# EasyEDA Pro project W51FXXXXS16_EVB_NONOFFICIAL_2026-06-30.epro

# Schematic Schematic1
Board Name: Board1; Create Date: 2026-06-29; Page Name: P1; Project Name: W51FXXXXS16_EVB_NO; Schematic Name: Schematic1; Update Date: 2026-06-29; Company: EasyEDA.com; Page Size: A4; Version: V1.0
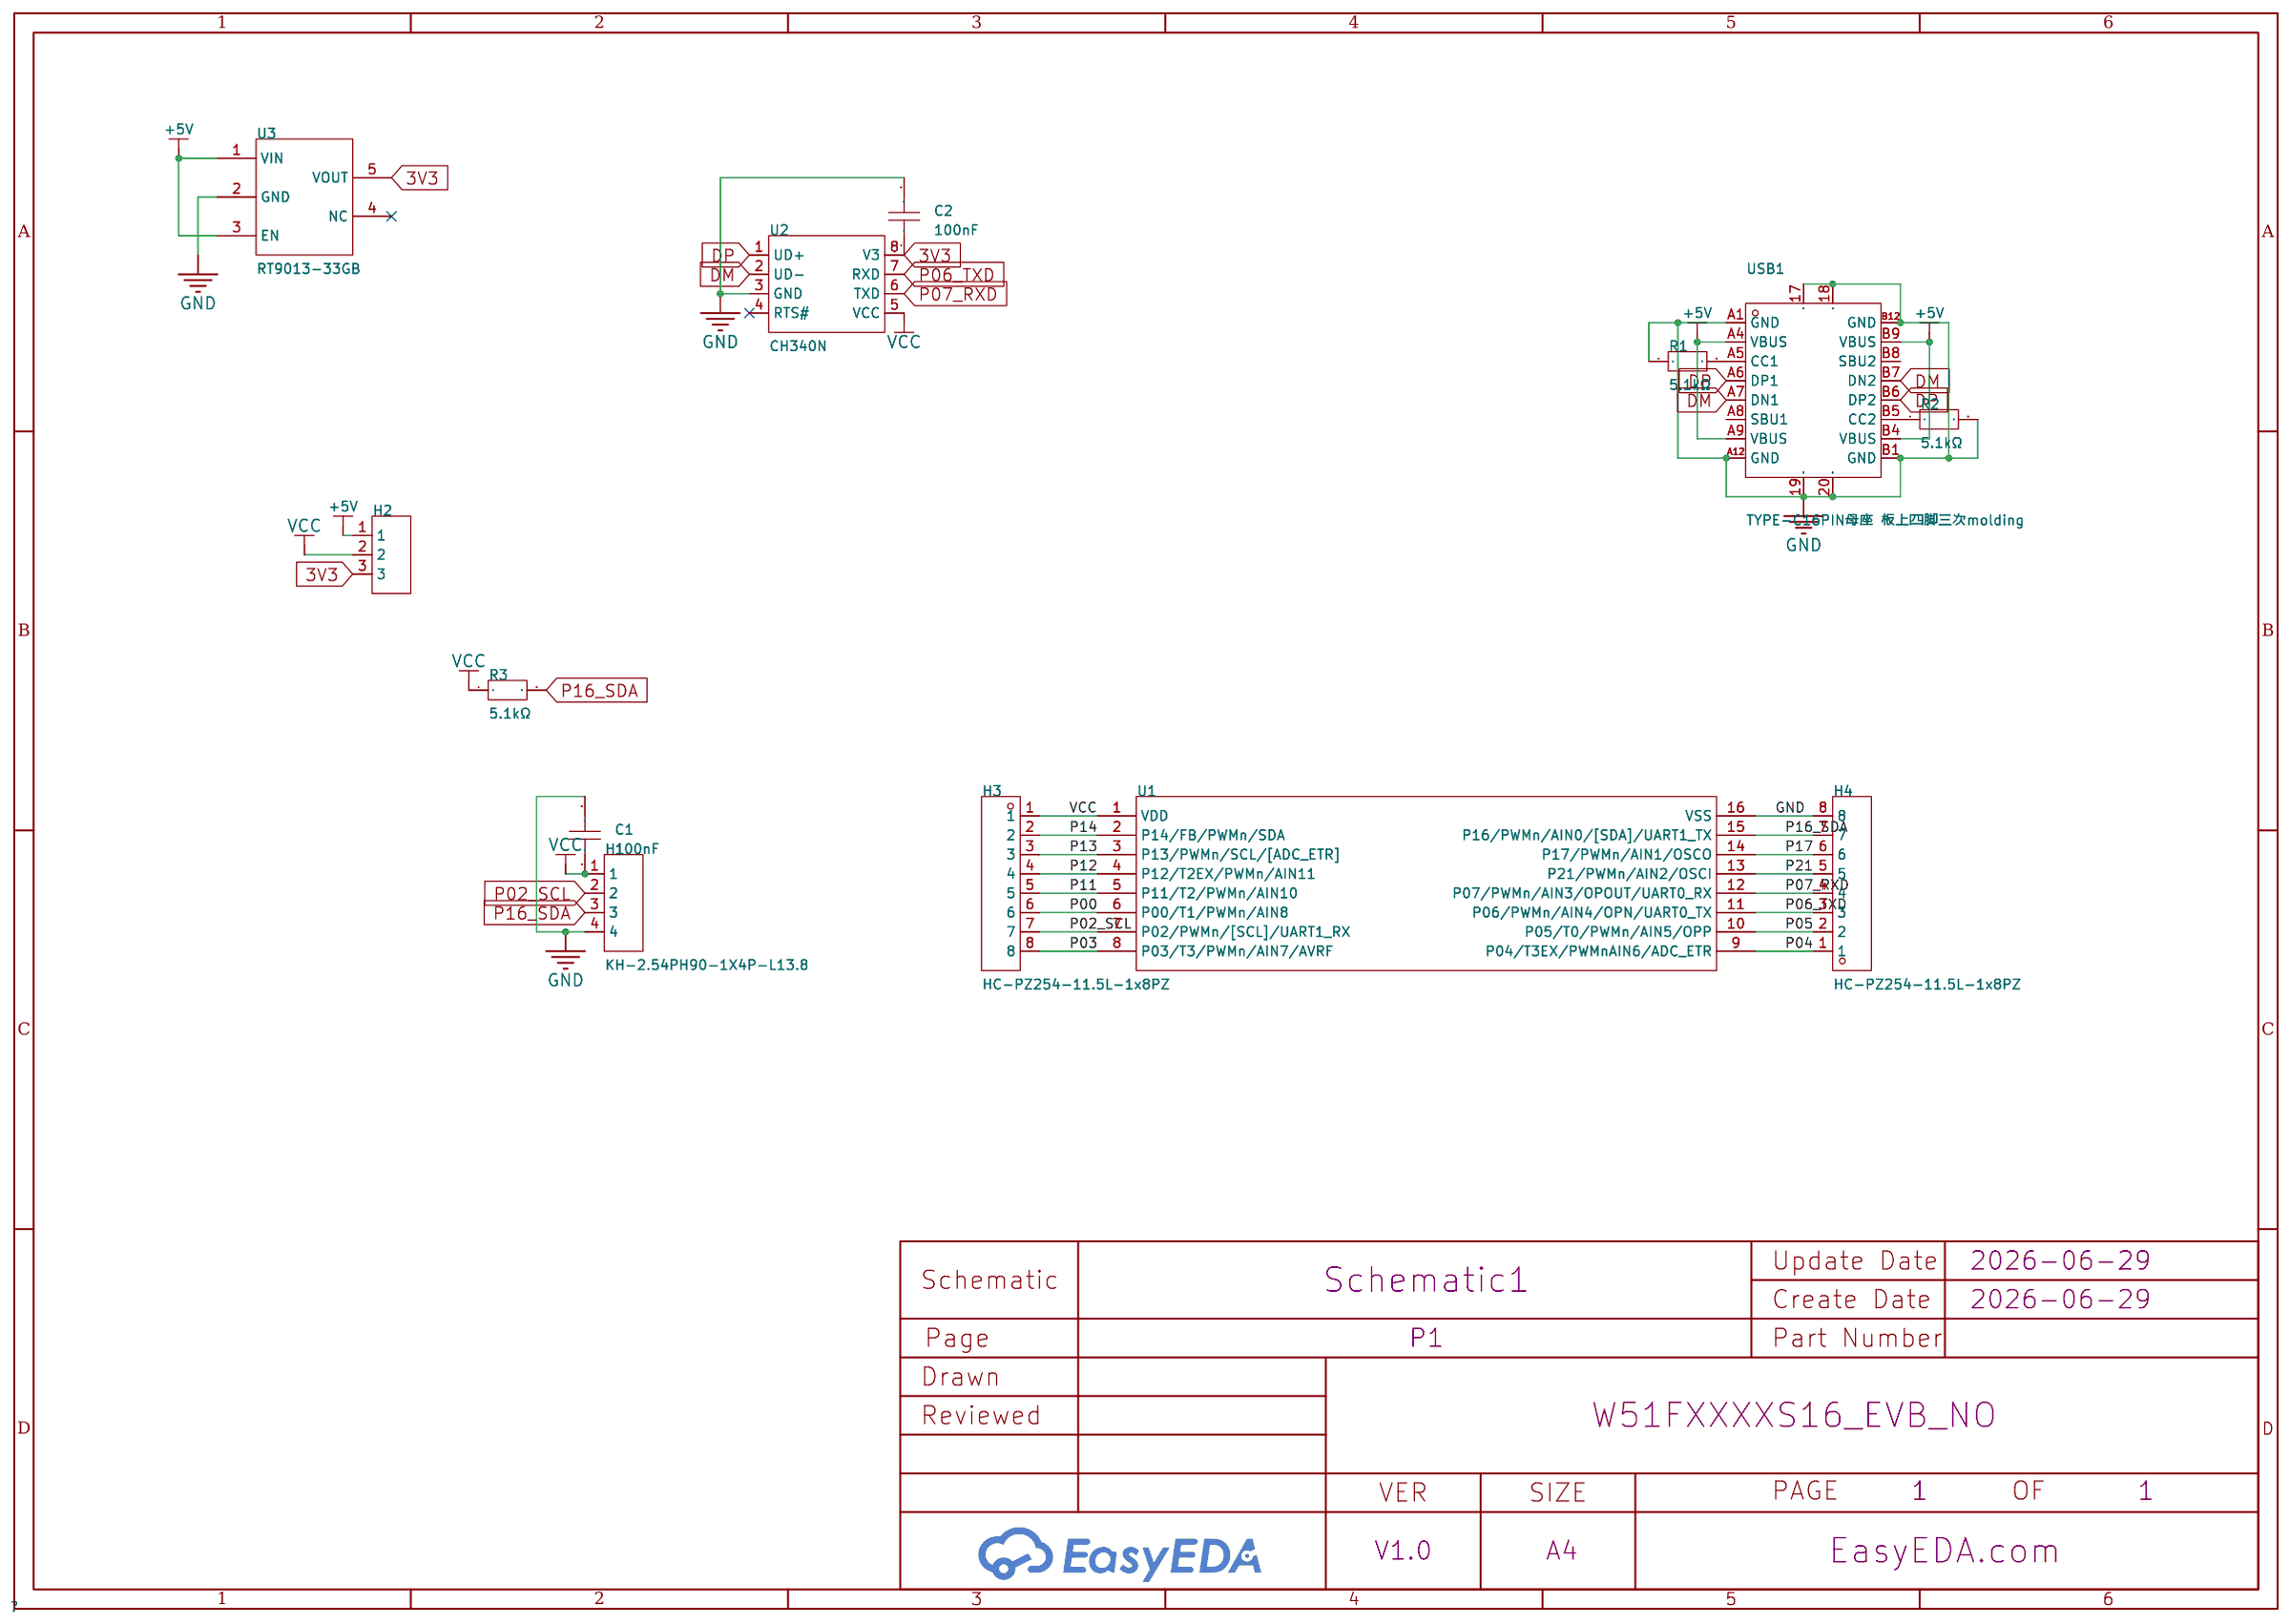
[diagram p0: schematic sheet]

## Parts
C1  100nF  [C1206]
C2  100nF  [C1206]
H1  KH-2.54PH90-1X4P-L13.8  [HDR-TH_4P-P2.54-H-M-W10.4-N]
H2  -  [HDR-TH_3P-P2.54-V-M]
H3  HC-PZ254-11.5L-1x8PZ  [HDR-TH_8P-P2.54-V-M]
H4  HC-PZ254-11.5L-1x8PZ  [HDR-TH_8P-P2.54-V-M]
R1  5.1kΩ  [R1206]
R2  5.1kΩ  [R1206]
R3  5.1kΩ  [R1206]
U1  -  [SOP-16_L10.0-W3.9-P1.27-LS6.0-TR]
U2  CH340N  [SOP-8_L4.9-W3.9-P1.27-LS6.0-BL]
U3  RT9013-33GB  [SOT-23-5_L3.0-W1.7-P0.95-LS2.8-BL]
USB1  TYPE-C16PIN母座 板上四脚三次molding  [USB-SMD_TYPE-C16PIN]

## Library data of the parts
C1 C2 = VJ1206Y104KLCAJ32: Capacitance:100nF Tolerance:±10% Tolerance:±10% Voltage Rating:200V Temperature Coefficient:X7R; LCSC Part Name: 100nF ±10% 200V; Supplier Part: C1513543; Manufacturer: VISHAY(威世); Supplier Footprint: 1206; JLCPCB Part Class: Extended Part; Datasheet: https://atta.szlcsc.com/upload/public/pdf/source/20210428/14560EB756A41667B9808D9FE1DC9776.pdf; Supplier: LCSC; Tolerance: ±10%; Voltage Rating: 200V; Temperature Coefficient: X7R
H1 = KH-2.54PH90-1X4P-L13.8: Pin Structure:1x4P Pitch:2.54mm Row Spacing:- Circluar Pins/Square Pins:Pin Header Mounting Type:Right Angle Number of Rows:1 Number of Pins:4P Current Rating:3A Voltage Rating (Max):- Length of Mating Pin:6mm Insulation Height:2.5mm Length of End Connect; LCSC Part Name: 1x4P 间距:2.54mm 方针 弯插; Supplier Part: C2905425; Manufacturer: kinghelm(金航标); Supplier Footprint: 弯插,P=2.54mm; JLCPCB Part Class: Extended Part; Datasheet: https://item.szlcsc.com/datasheet/KH-2.54PH90-1X4P-L13.8/3175213.html; Supplier: LCSC; Pin Structure: 1x4P; Pitch: 2.54mm; Circluar Pins/Square Pins: Pin Header; Mounting Type: Right Angle; Number of Rows: 1; Number of Pins: 4P; Current Rating: 3A; Length of Mating Pin: 6mm; Insulation Height: 2.5mm; Operating Temperature: -40℃~+105℃; Color: Black
H2 = HDR-M_2.54_1x3P: Supplier Footprint: Through
H3 H4 = HC-PZ254-11.5L-1x8PZ: Pin Structure:1x8P Pitch:2.54mm Row Spacing:- Circluar Pins/Square Pins:Pin Header Mounting Type:Through Hole Number of Rows:1 Number of Pins:8P Current Rating:3A Voltage Rating (Max):- Length of Mating Pin:6mm Insulation Height:2.5mm Length of End Connec; LCSC Part Name: 1x8P 间距:2.54mm 方针 直插; Supplier Part: C27985192; Manufacturer: HC(虹成电子); Supplier Footprint: 插件,P=2.54mm; JLCPCB Part Class: Extended Part; Datasheet: https://item.szlcsc.com/datasheet/HC-PZ254-11.5L-1x8PZ/29721150.html; Supplier: LCSC; Pin Structure: 1x8P; Pitch: 2.54mm; Circluar Pins/Square Pins: Pin Header; Mounting Type: Through Hole; Number of Rows: 1; Number of Pins: 8P; Current Rating: 3A; Length of Mating Pin: 6mm; Insulation Height: 2.5mm; Length of End Connection Pin: 3mm; Contact Material: Brass; Contact Plating: Gold; Operating Temperature: -40℃~+105℃; Color: Black
R1-R3 = CQ06W4F5101T5E: Type:Thick Film Resistor Resistance:5.1kΩ Tolerance:±1% Tolerance:±1% Power(Watts):250mW Voltage-Supply(Max):200V Temperature Coefficient:±100ppm/℃ Temperature Coefficient:±100ppm/℃ Operating Temperature:-55℃~+155℃ Operating Temperature:-55℃~+155℃; LCSC Part Name: 5.1kΩ ±1% 250mW 汽车级晶片电阻器; Supplier Part: C966417; Manufacturer: UNI-ROYAL(厚声); Supplier Footprint: 1206; JLCPCB Part Class: Extended Part; Datasheet: https://item.szlcsc.com/datasheet/CQ06W4F5101T5E/1052285.html; Supplier: LCSC; Type: Thick Film Resistor; Tolerance: ±1%; Power(Watts): 250mW; Voltage-Supply(Max): 200V; Temperature Coefficient: ±100ppm/℃; Operating Temperature: -55℃~+155℃
U1 = W51F6240S16: Low cost 1T 8051 MCU
U2 = CH340N: Applications Function:USB to serial USB Protocol:USB 2.0 Number of Channels:1 Voltage - Supply:3.3V；5V Voltage - Supply:3.3V；5V Data Rate:2Mbps Operating Temperature:-20℃~+70℃ Operating Temperature:-20℃~+70℃ Features:可编程波特率；内置时钟发生器；上电复位; LCSC Part Name: USB2.0芯片CH340; Supplier Part: C2977777; Manufacturer: WCH(南京沁恒); Supplier Footprint: SOP-8; JLCPCB Part Class: Extended Part; Datasheet: https://item.szlcsc.com/datasheet/CH340N/3390257.html; Supplier: LCSC; Applications Function: USB to serial; USB Protocol: USB 2.0; Number of Channels: 1; Voltage - Supply: 3.3V；5V; Data Rate: 2Mbps; Operating Temperature: -20℃~+70℃; Features: 可编程波特率；内置时钟发生器；上电复位
U3 = RT9013-33GB: Output Configuration:Positive Voltage - Supply:5.5V Output Voltage:3.3V Output Voltage:3.3V Output Current:500mA Power Supply Rejection Ratio (PSRR):50dB@(10kHz) Voltage Dropout:400mV@(500mA) standby current:25uA Noise:30uVrms Features:Enable control；Shor; LCSC Part Name: 3.3V 500mA 5.5V; Supplier Part: C47773; Manufacturer: RICHTEK(立锜); Supplier Footprint: SOT-23-5; JLCPCB Part Class: Extended Part; Datasheet: https://item.szlcsc.com/datasheet/RT9013-33GB/48778.html; Supplier: LCSC; Output Configuration: Positive; Voltage - Supply: 5.5V; Output Voltage: 3.3V; Output Current: 500mA; Power Supply Rejection Ratio (PSRR): 50dB@(10kHz); Voltage Dropout: 400mV@(500mA); standby current: 25uA; Noise: 30uVrms; Features: Enable control；Short Circuit Protection；Over Current Protection；Thermal shutdown; Operating Temperature: -40℃~+125℃@(Tj); Output Type: Fixed; Number of Outputs: 1
USB1 = TYPE-C16PIN母座 板上四脚三次molding: Supplier Part: C9900000202; Supplier Footprint: TYPE-C16PIN; JLCPCB Part Class: Extended Part; Supplier: LCSC

## Nets
3V3: C2.1 H2.3 U2.8(V3) U3.5(VOUT)
+5V: H2.1 U3.1(VIN) U3.3(EN) USB1.A4(VBUS) USB1.A9(VBUS) USB1.B4(VBUS) USB1.B9(VBUS)
GND: C1.2 C2.2 H1.4 H4.8 R1.1 R2.2 U1.16(VSS) U2.3(GND) U3.2(GND) USB1.17 USB1.18 USB1.19 USB1.20 USB1.A1(GND) USB1.A12(GND) USB1.B1(GND) USB1.B12(GND)
VCC: C1.1 H1.1 H2.2 H3.1 R3.1 U1.1(VDD) U2.5(VCC)
DM: U2.2(UD-) USB1.A7(DN1) USB1.B7(DN2)
DP: U2.1(UD+) USB1.A6(DP1) USB1.B6(DP2)
P00: H3.6 U1.6(P00/T1/PWMn/AIN8)
P02_SCL: H1.2 H3.7 U1.7(P02/PWMn/[SCL]/UART1_RX)
P03: H3.8 U1.8(P03/T3/PWMn/AIN7/AVRF)
P04: H4.1 U1.9(P04/T3EX/PWMnAIN6/ADC_ETR)
P05: H4.2 U1.10(P05/T0/PWMn/AIN5/OPP)
P06_TXD: H4.3 U1.11(P06/PWMn/AIN4/OPN/UART0_TX) U2.7(RXD)
P07_RXD: H4.4 U1.12(P07/PWMn/AIN3/OPOUT/UART0_RX) U2.6(TXD)
P11: H3.5 U1.5(P11/T2/PWMn/AIN10)
P12: H3.4 U1.4(P12/T2EX/PWMn/AIN11)
P13: H3.3 U1.3(P13/PWMn/SCL/[ADC_ETR])
P14: H3.2 U1.2(P14/FB/PWMn/SDA)
P16_SDA: H1.3 H4.7 R3.2 U1.15(P16/PWMn/AIN0/[SDA]/UART1_TX)
P17: H4.6 U1.14(P17/PWMn/AIN1/OSCO)
P21: H4.5 U1.13(P21/PWMn/AIN2/OSCI)
$1N2443: R1.2 USB1.A5(CC1)
$1N2482: R2.1 USB1.B5(CC2)

Not connected (* = marked no-connect by the designer): U2 4(RTS#)*; U3 4(NC)*; USB1 A8(SBU1) B8(SBU2)

# Board PCB1
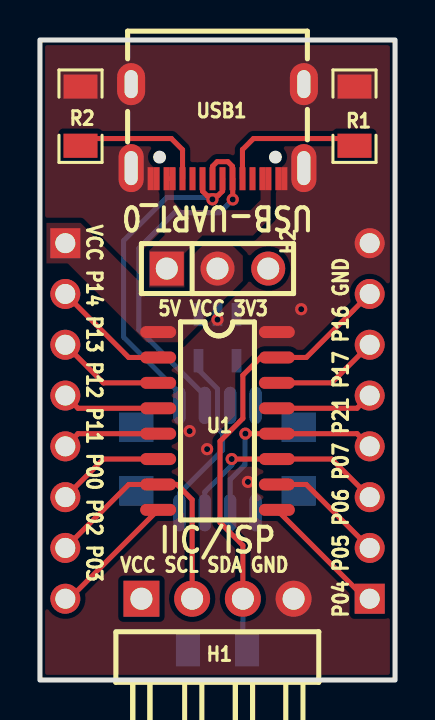
[diagram p1: board, top side]
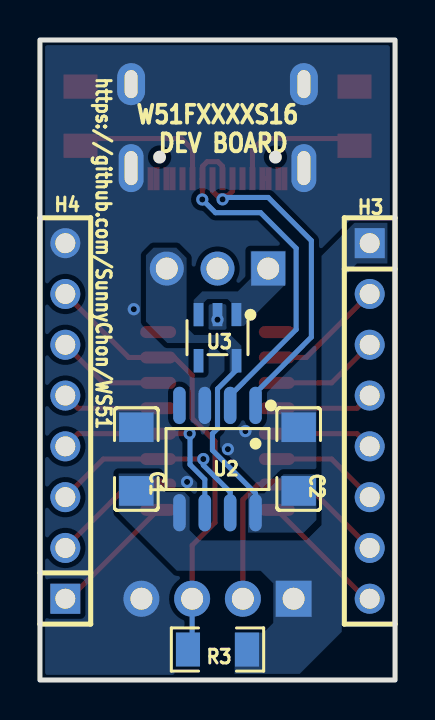
[diagram p2: board, bottom side, seen from below]

Outline 17.78 x 32 mm; copper layers: Top Layer, Bottom Layer. Coordinates in mm from the lower left corner of the outline.
Outline path: rectangle 0,32 17.78,0
Stack: Top Layer 0.035mm / Dielectric1 1.51mm FR4 er 4.5 / Bottom Layer 0.035mm

## Design rules (mm)
template: 自定义配置
spacing copperThickness1oz (default): track to track 0.102, other pairs 0.152 to 0.3
spacing copperThickness2oz: track to track 0.203, other pairs 0.152 to 0.3
track width copperThickness1oz (default): min 0.127, default 0.254, max 2.54
track width copperThickness2oz: min 0.203, default 0.254, max 2.54
differential pair differentialPair (default): width min 0.127, default 0.254, max 2.54; gap min 0.152, default 0.152
via viaSize (default): diameter min 0.5, default 0.61, max 10; hole min 0.3, default 0.305, max 6.3

## Placement (name value [footprint] x y rotation side)
C1  100nF  [C1206]  12.95 11.05 90 bottom
C2  100nF  [C1206]  4.83 11.05 90 bottom
H1  KH-2.54PH90-1X4P-L13.8  [HDR-TH_4P-P2.54-H-M-W10.4-N]  8.89 4.06 0 top
H2  -  [HDR-TH_3P-P2.54-V-M]  8.89 20.57 0 top
H3  HC-PZ254-11.5L-1x8PZ  [HDR-TH_8P-P2.54-V-M]  1.27 12.95 270 bottom
H4  HC-PZ254-11.5L-1x8PZ  [HDR-TH_8P-P2.54-V-M]  16.51 12.95 90 bottom
R1  5.1kΩ  [R1206]  15.75 28.19 270 top
R2  5.1kΩ  [R1206]  2.03 28.19 90 top
R3  5.1kΩ  [R1206]  8.89 1.52 0 bottom
U1  -  [SOP-16_L10.0-W3.9-P1.27-LS6.0-TR]  8.89 12.95 90 top
U2  CH340N  [SOP-8_L4.9-W3.9-P1.27-LS6.0-BL]  8.89 11.05 0 bottom
U3  RT9013-33GB  [SOT-23-5_L3.0-W1.7-P0.95-LS2.8-BL]  8.89 17.12 0 bottom
USB1  TYPE-C16PIN母座 板上四脚三次molding  [USB-SMD_TYPE-C16PIN]  8.89 27.43 180 top

## Footprints (pads in the part's own frame, mm; a bottom-side part is the same pattern mirrored in y, then rotated)
C1206
  rect 1.485x1.728 smd: 1(-1.593,0) 2(1.593,0)
HDR-TH_3P-P2.54-V-M
  rect 1.7x1.7 hole 1.1: 1(-2.54,0)
  round 1.7 hole 1.1: 2(0,0) 3(2.54,0)
HDR-TH_4P-P2.54-H-M-W10.4-N
  rect 1.8x1.8 hole 1.1: 1(-3.81,0)
  round 1.8 hole 1.1: 2(-1.27,0) 3(1.27,0) 4(3.81,0)
HDR-TH_8P-P2.54-V-M
  rect 1.5x1.5 hole 1: 1(-8.89,0)
  round 1.5 hole 1: 2(-6.35,0) 3(-3.81,0) 4(-1.27,0) 5(1.27,0) 6(3.81,0) 7(6.35,0) 8(8.89,0)
R1206
  rect 1.208x1.701 smd: 1(-1.479,0) 2(1.479,0)
SOP-8_L4.9-W3.9-P1.27-LS6.0-BL
  oval 0.63x1.865 smd: 1(-1.905,-2.683) 2(-0.635,-2.683) 3(0.635,-2.683) 4(1.905,-2.683) 5(1.905,2.683) 6(0.635,2.683) 7(-0.635,2.683) 8(-1.905,2.683)
SOP-16_L10.0-W3.9-P1.27-LS6.0-TR
  oval 0.6x1.8 smd: 1(4.445,2.971) 2(3.175,2.971) 3(1.905,2.971) 4(0.635,2.971) 5(-0.635,2.971) 6(-1.905,2.971) 7(-3.175,2.971) 8(-4.445,2.971) 9(-4.445,-2.972) 10(-3.175,-2.972) 11(-1.905,-2.972) 12(-0.635,-2.972) 13(0.635,-2.972) 14(1.905,-2.972) 15(3.175,-2.972) 16(4.445,-2.972)
SOT-23-5_L3.0-W1.7-P0.95-LS2.8-BL
  rect 0.49x1.157 smd: 1(-0.95,-1.153) 2(0,-1.153) 3(0.95,-1.153)
  rect 0.49x1.175 smd: 4(0.95,1.153) 5(-0.95,1.153)
USB-SMD_TYPE-C16PIN
  oval 1.25x2.4 hole 0.65x1.7: 17(-4.325,1.835) 18(4.325,1.835)
  oval 1.4x2.1 hole 0.65x1.4: 19(-4.325,-2.365) 20(4.325,-2.365)
  rect 0.3x1.15 smd: A1(-3.35,2.365) A4(-2.55,2.365) A5(-1.25,2.365) A6(-0.25,2.365) A7(0.25,2.365) A8(1.25,2.365) A9(2.55,2.365) A12(3.35,2.365) B1(3.05,2.365) B4(2.25,2.365) B5(1.75,2.365) B6(0.75,2.365) B7(-0.75,2.365) B8(-1.75,2.365) B9(-2.25,2.365) B12(-3.05,2.365)

## Nets
As in the schematic.

Pads without a net: U2 4; U3 4; USB1 A8 B8

## Via types
v1: diameter 0.61, hole 0.305, Top Layer to Bottom Layer, 9 vias

## Routing (per net, layer and track width the routed paths; a pad name or vN(x,y) marks a point on that pad's centre or on a via; arc(x,y) is an arc through that point)
3V3: length 9
  Bottom Layer w0.254: U2.8 6.98,9.33 9.14,11.49 9.14,12.32 8.89,12.57 8.89,14.55 7.94,15.5 U3.5
+5V: length 0.3
  Top Layer w0.254: USB1.A9 USB1.B4
GND:
  vias: v1(7.49,12.45) v1(8.37,11.54) v1(8.89,18.02) v1(10.41,9.91) v1(13.08,18.54)
DM: length 18.4
  Top Layer w0.254: v1(9.65,24.03) 9.65,25.05 USB1.B7 9.64,25.69 9.41,25.92 8.87,25.92 8.64,25.69 USB1.A7
  Bottom Layer w0.254: v1(9.65,24.03) 8.99,23.37 6.73,23.37 4.95,21.59 4.95,17.53 8.25,14.22 U2.2
DP: length 17.2
  Top Layer w0.254: USB1.B6 8.14,24.45 8.37,24.21 8.91,24.21 9.14,24.45 9.14,25.06 USB1.A6
  Bottom Layer w0.254: 8.64,24.13 6.35,24.13 4.19,21.97 4.19,17.14 6.98,14.35 U2.1
  vias: v1(8.64,24.03)
P00: length 5.4
  Top Layer w0.254: H3.6 3.17,11.05 U1.6
P02_SCL: length 12.9
  Top Layer w0.254: H3.7 4.44,9.78 U1.7 6.86,9.78 7.62,9.02 H1.2
P03: length 6.5
  Top Layer w0.254: H3.8 1.47,4.06 U1.8
P04: length 6.5
  Top Layer w0.254: H4.1 16.31,4.06 U1.9
P05: length 6
  Top Layer w0.254: U1.10 13.33,9.78 H4.2
P06_TXD: length 10.9
  Top Layer w0.254: H4.3 14.6,11.05 U1.11 v1(9.6,11.05)
  Bottom Layer w0.254: v1(9.6,11.05) 9.6,10.74 8.25,9.4 U2.7
P07_RXD: length 10.8
  Top Layer w0.254: v1(10.29,12.32) U1.12 15.88,12.32 H4.4
  Bottom Layer w0.254: v1(10.29,12.32) 10.26,12.3 10.26,10.77 9.52,10.03 U2.6
P11: length 4.9
  Top Layer w0.254: U1.5 1.9,12.32 H3.5
P12: length 4.9
  Top Layer w0.254: H3.4 1.9,13.59 U1.4
P13: length 5.4
  Top Layer w0.254: H3.3 3.17,14.86 U1.3
P14: length 6
  Top Layer w0.254: H3.2 4.44,16.13 U1.2
P16_SDA: length 22.8
  Top Layer w0.254: H4.7 13.33,16.13 U1.15 11.05,16.13 10.16,15.24 10.16,13.08 9.02,11.94 9.02,7.87 10.16,6.73 H1.3
  Bottom Layer w0.254: H1.3 10.16,1.73 R3.2
P17: length 5.4
  Top Layer w0.254: H4.6 14.6,14.86 U1.14
P21: length 4.9
  Top Layer w0.254: U1.13 15.88,13.59 H4.5
$1N2443: length 7.4
  Top Layer w0.254: R1.2 15.39,27.08 10.69,27.08 10.14,26.52 USB1.A5
$1N2482: length 6.9
  Top Layer w0.254: R2.1 2.39,27.08 6.58,27.08 7.14,26.52 USB1.B5

## Copper pours and planes (outline as drawn; the poured copper is in the pictures)
3V3 on Bottom Layer: 3.94,10.29 7.37,10.29 7.37,7.37 3.94,7.37
3V3 on Bottom Layer: 7.7,21.62 12.47,21.62 12.47,15.39 7.7,15.39
+5V on Top Layer: 5.46,25.53 11.56,25.53 11.56,19.64 5.46,19.64
+5V on Bottom Layer: 5.46,21.46 10.08,21.46 10.08,17.68 5.46,17.68
GND on Top Layer: 0,32 17.78,32 17.78,-1.02 0,-1.02
GND on Bottom Layer: 0,32 17.78,32 17.78,-1.02 0,-1.02
VCC on Top Layer: 0.33,22.86 10.16,22.86 10.16,16.89 0.33,16.89
VCC on Bottom Layer: 0.38,22.86 13.84,22.86 13.84,0.3 0.38,0.3

## Text on the board
Bottom Silkscreen Layer: https://github.com/SunnyChon/WS51 | W51FXXXXS16 / DEV BOARD
Top Silkscreen Layer: VCC SCL SDA GND | 5V VCC 3V3 | P04 P05 P06 P07 P21 P17 P16 GND | VCC P14 P13 P12 P11 P00 P02 P03 | USB-UART_0 | IIC/ISP
